# Altium schematic sheet view.SchDoc
size A4
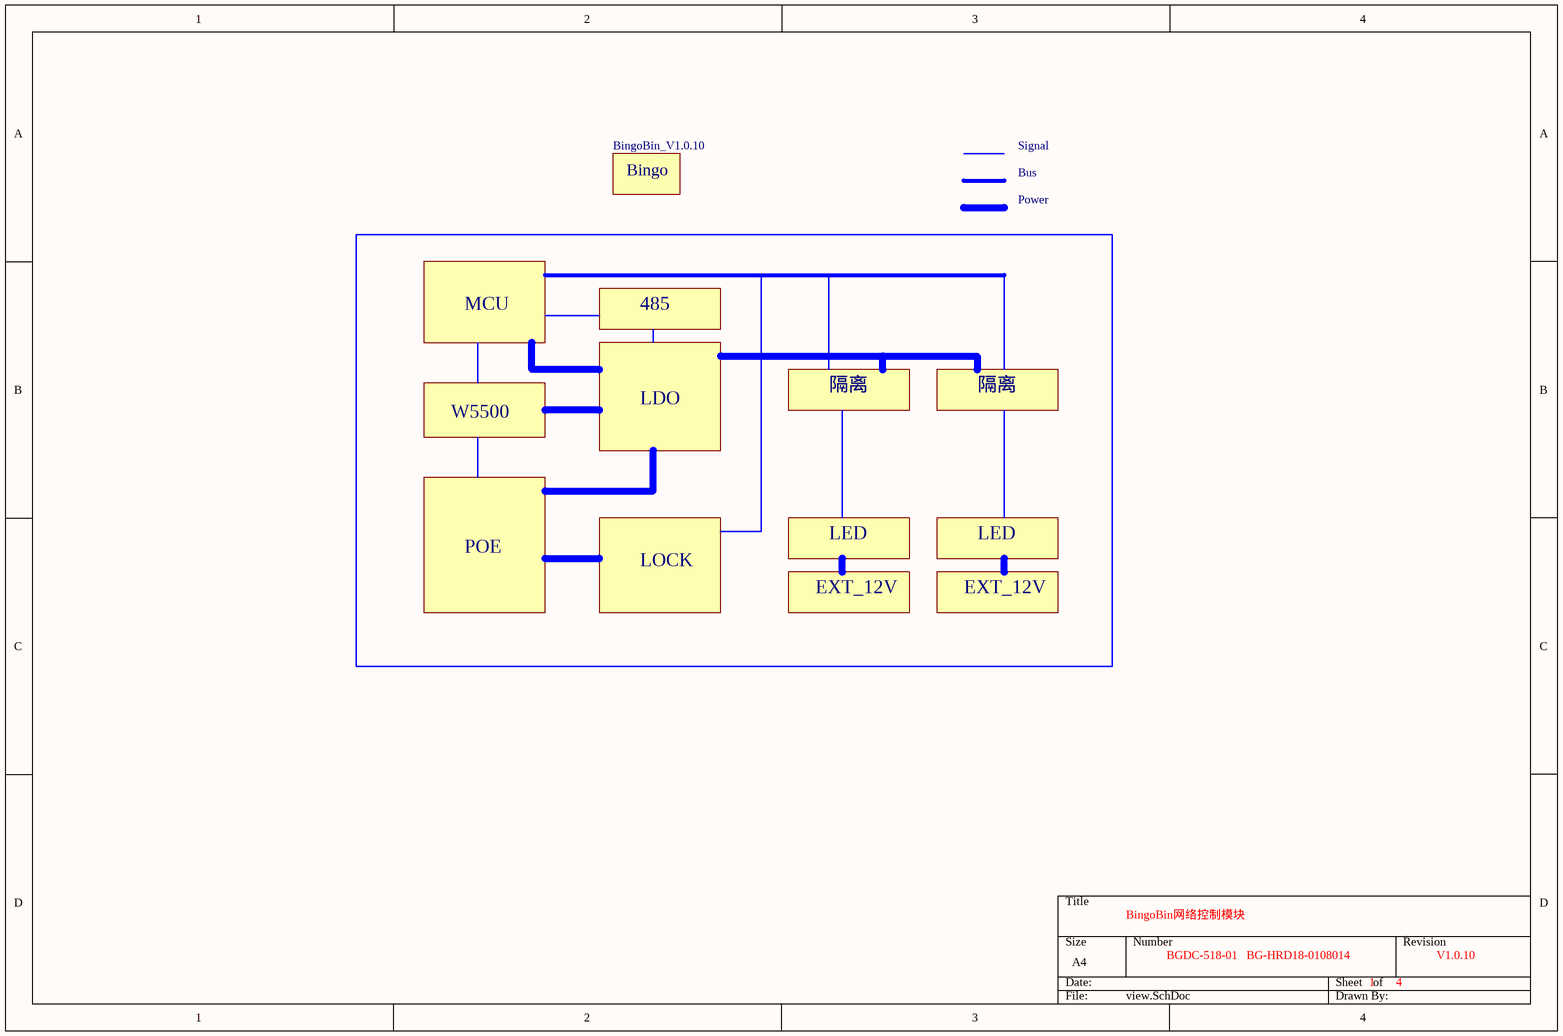
[diagram p0: view.SchDoc]

## Parts
BingoBin_V1.0.10  BingoBin_V1.0.10  [bingo_logo]  (value not drawn)

## Notes on the sheet
- Signal
- Bus
- Power
- MCU
- 485
- W5500
- LDO
- 隔离
- POE
- LOCK
- LED
- EXT_12V
- BingoBin网络控制模块
- BGDC-518-01   BG-HRD18-0108014
- 1
- 4
- V1.0.10
- (in symbol bingo_logo) Bingo

## Library data of the parts
BingoBin_V1.0.10 = bingo_logo: bingo logo; value: BingoBin_V1.0.10